# EAGLE design bioamplifierALL201820 (EAGLE 7.7.0)

## Sheet 1 of 2
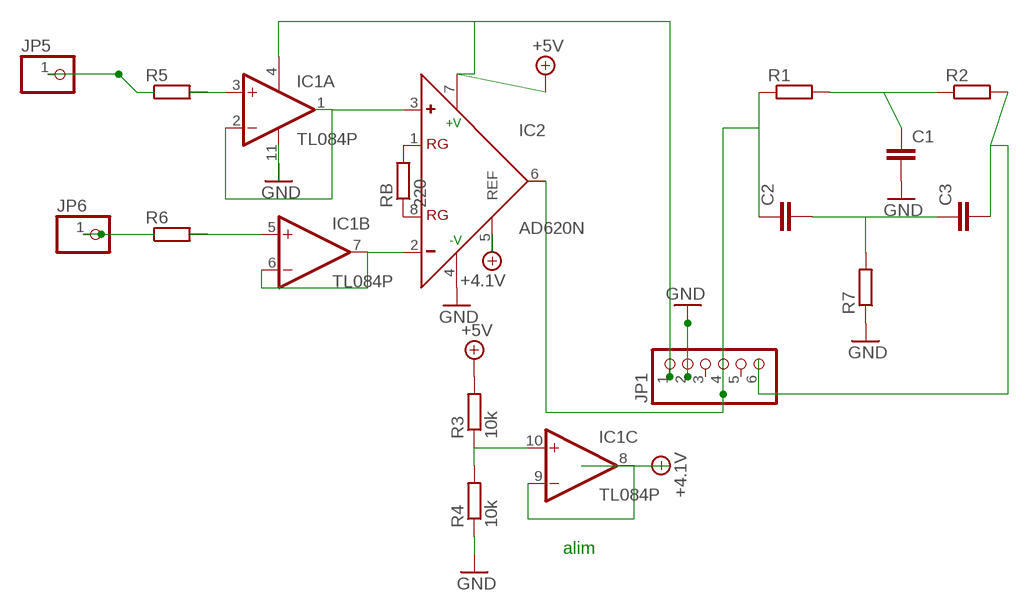
[diagram p0: schematic, sheet 1]

### Parts
C1  C-EU050-025X075  [C050-025X075]
C2  C-EU050-025X075  [C050-025X075]
C3  C-EU050-025X075  [C050-025X075]
IC1  TL084P  [DIL14]
IC2  AD620N  [DIL08]
JP1  PINHD-1X6  [1X06]
JP5  PINHD-1X1  [1X01]
JP6  PINHD-1X1  [1X01]
R1  R-EU_0204/7  [0204/7]
R2  R-EU_0204/7  [0204/7]
R3  10k  R-EU_0204/5  [0204/5]
R4  10k  R-EU_0204/5  [0204/5]
R5  R-EU_0204/5  [0204/5]
R6  R-EU_0204/5  [0204/5]
R7  R-EU_0204/7  [0204/7]
RB  220  R-EU_0204/5  [0204/5]

### Nets
+4.1V: IC2.5(REF)
+5V: IC1.4(P:V+) IC2.7(+V) JP1.1 R3.2
GND: C1.2 IC1.11(P:V-) IC2.4(-V) JP1.2 R4.1 R7.1
N$2: IC1.10(C:+IN) R3.1 R4.2
N$3: IC2.1(RG) RB.2
N$4: JP1.4
N$5: JP5.1 R5.1
N$6: IC1.1(A:OUT) IC1.2(A:-IN) IC2.3(+)
N$7: JP6.1 R6.1
N$8: IC1.5(B:+IN) R6.2
N$9: C1.1 R1.2 R2.1
N$10: C3.2 JP1.6 R2.2
N$11: IC2.8(RG) RB.1
N$12: IC1.3(A:+IN) R5.2
N$14: C2.1 IC2.6(OUT) R1.1
N$15: IC1.8(C:OUT) IC1.9(C:-IN)
N$16: C2.2 C3.1 R7.2
N$17: IC1.6(B:-IN) IC1.7(B:OUT) IC2.2(-)
Unconnected: IC1.12(D:+IN) IC1.13(D:-IN) IC1.14(D:OUT) JP1.3 JP1.5

### Notes on the sheet
- alim

## Sheet 2 of 2

## Library data of the parts
C1-C3 = resistor:C-EU: CAPACITOR, European symbol
IC1 = linear:TL084: OP AMP
IC2 = analog-devices:AD620: Low Cost, Low Power, Instrumentation Amplifier Source: http://www.analog.com/UploadedFiles/Data_Sheets/37793330023930AD620_e.pdf; MF: ALTERA CORPORATION; MPN: AD620AN; OC_FARNELL: 1523782; OC_NEWARK: 05F7108
JP1 = pinhead:PINHD-1X6: PIN HEADER
JP5 JP6 = pinhead:PINHD-1X1: PIN HEADER
R1-R7 RB = resistor:R-EU_: RESISTOR, European symbol

## Board
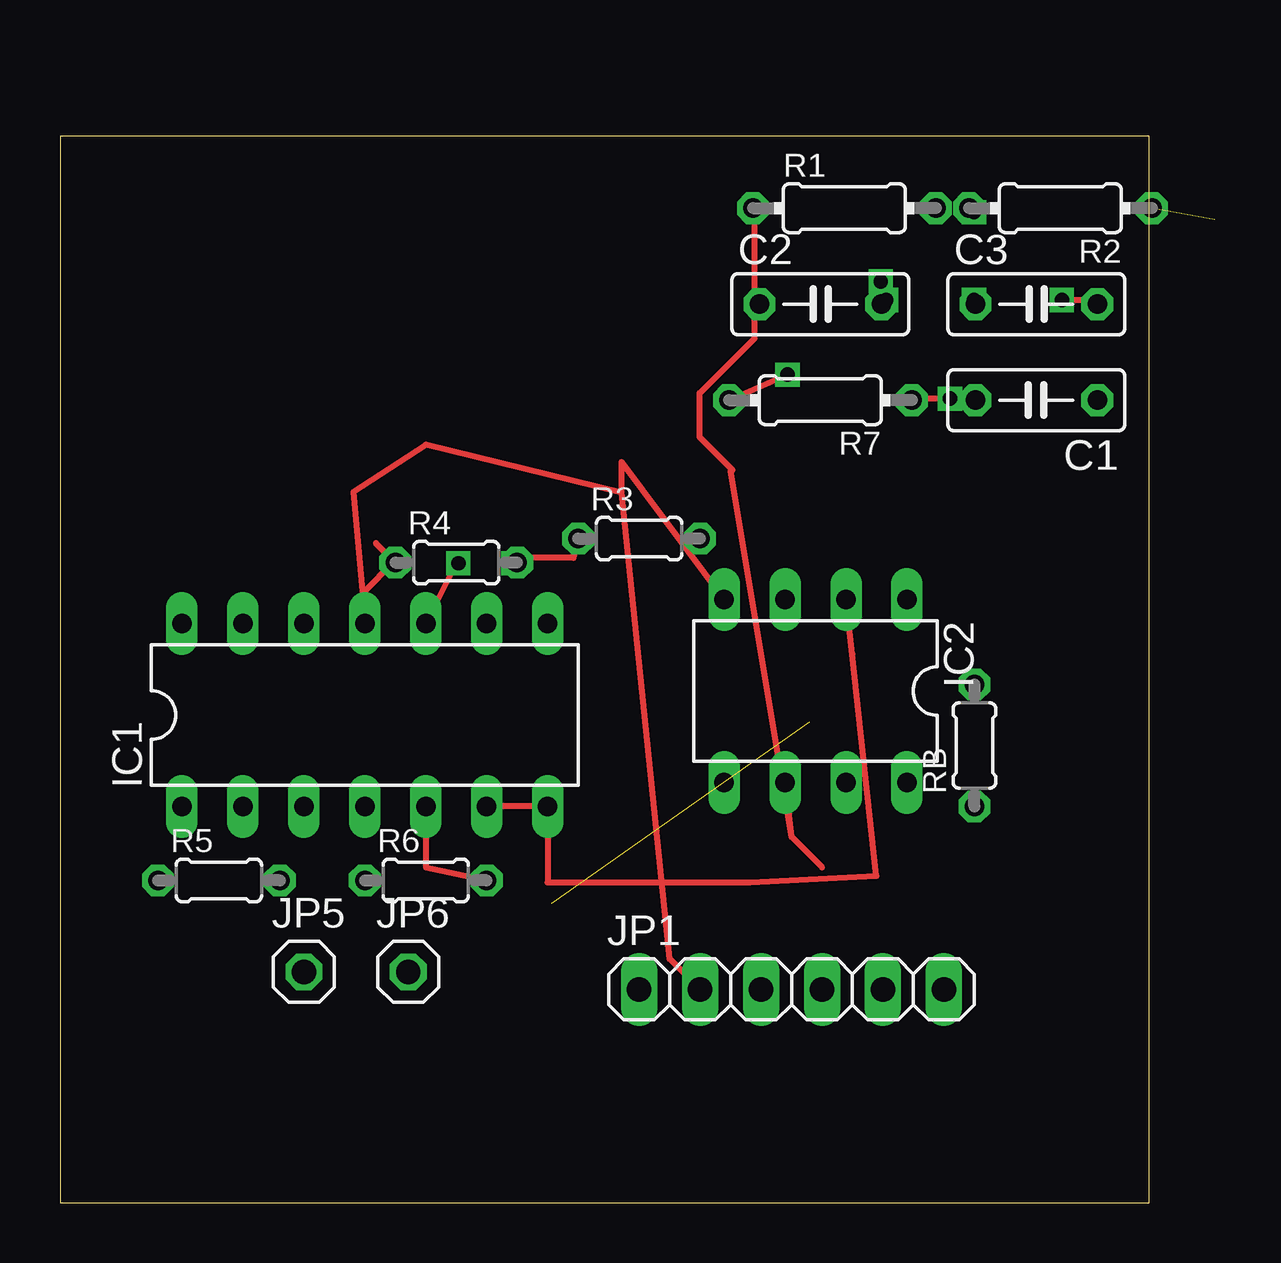
[diagram p1: board, top side]
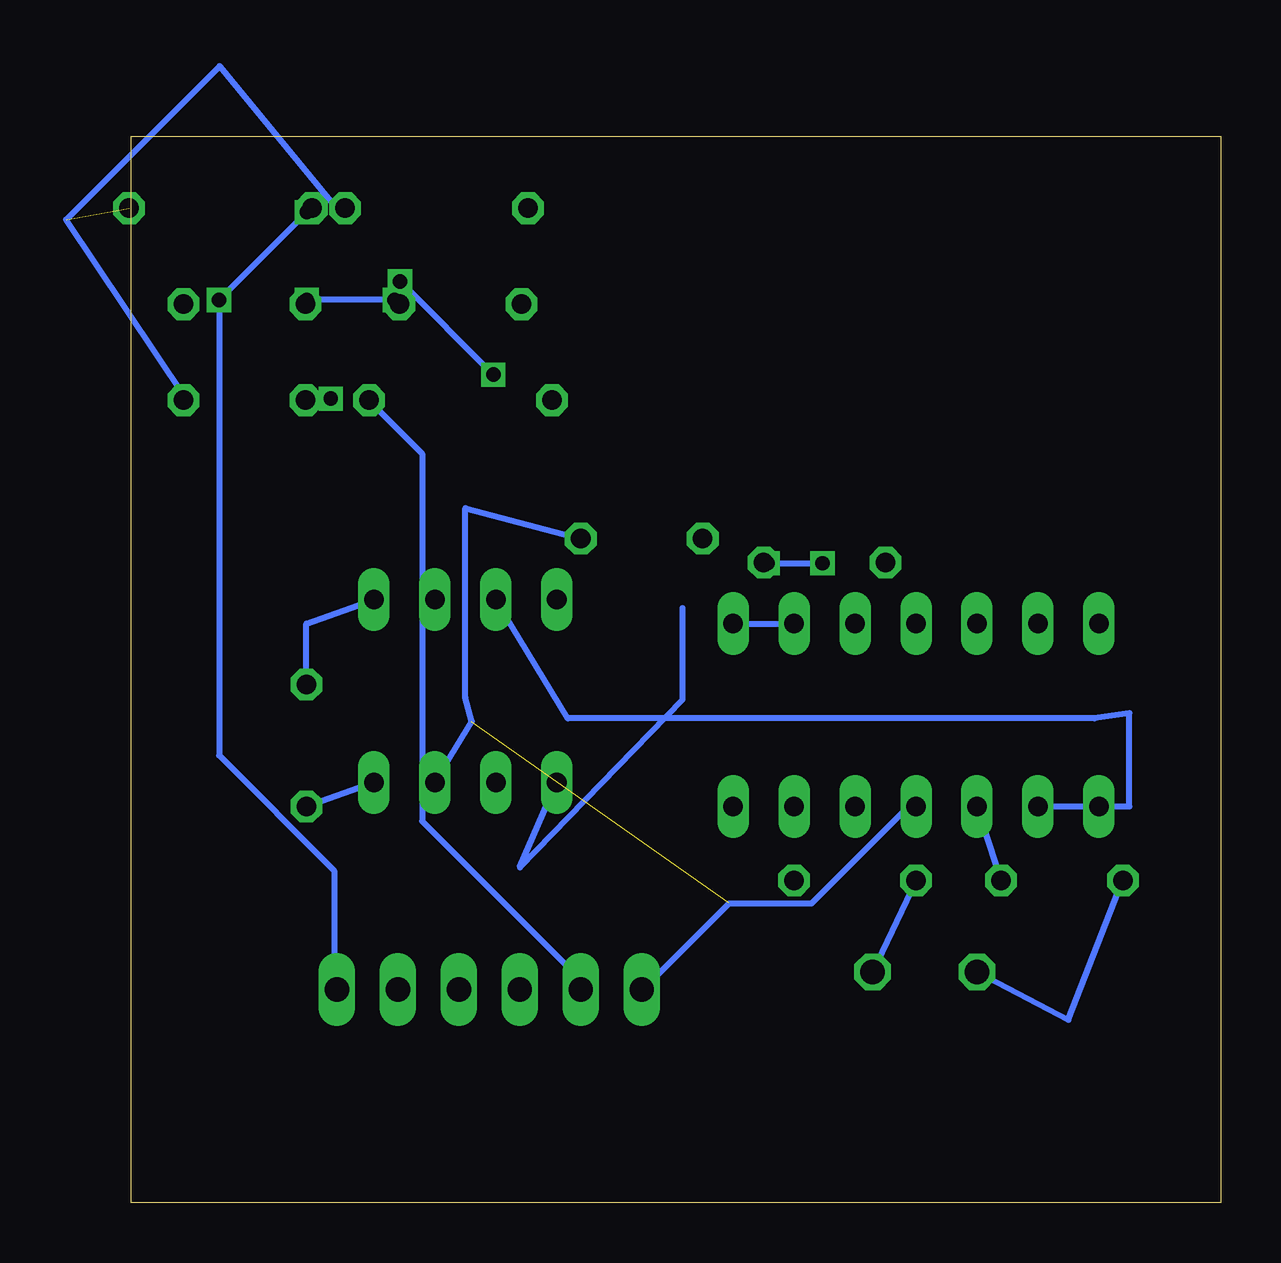
[diagram p2: board, bottom side, seen from below]

Size 45.39 x 44.44 mm. Coordinates in mm from the lower left corner, seen from the top.
Outline: 0,0 45.39,0 45.39,44.44 0,44.44 0,0
Copper layers (1*16): Top 0.035mm / dielectric 1.5mm / Bottom 0.035mm
Design rules "default": minimum track width 10mil, minimum drill 24mil, track to track 8mil, track to pad 8mil, pad to pad 8mil, via to via 8mil, smd to smd 8mil, copper to edge 40mil, drill to drill 8mil, minimum pad ring 10mil, minimum via ring 8mil, stop-mask expansion 4mil, vias tented up to drill 0mil, thermal gap 10mil

### Footprints (pad centres in the part's own frame; a part is rotated, then mirrored left to right if it is on the bottom)
C050-025X075 = drill 0.813 octagon: 1 -2.54,0; 2 2.54,0
DIL14 = drill 0.813 long: 1 -7.62,-3.81; 2 -5.08,-3.81; 3 -2.54,-3.81; 4 0,-3.81; 5 2.54,-3.81; 6 5.08,-3.81; 7 7.62,-3.81; 8 7.62,3.81; 9 5.08,3.81; 10 2.54,3.81; 11 0,3.81; 12 -2.54,3.81; 13 -5.08,3.81; 14 -7.62,3.81
DIL08 = drill 0.813 long: 1 -3.81,-3.81; 2 -1.27,-3.81; 3 1.27,-3.81; 4 3.81,-3.81; 5 3.81,3.81; 6 1.27,3.81; 7 -1.27,3.81; 8 -3.81,3.81
1X06 = drill 1.016 long: 1 -6.35,0; 2 -3.81,0; 3 -1.27,0; 4 1.27,0; 5 3.81,0; 6 6.35,0
1X01 = drill 1.016 octagon: 1 0,0
0204/7 = drill 0.813 octagon: 1 -3.81,0; 2 3.81,0
0204/5 = drill 0.813 octagon: 1 -2.54,0; 2 2.54,0

### Placement (x,y rotation side)
C1  40.68,33.44 180 top
C2  31.68,37.44 0 top
C3  40.68,37.44 0 top
IC1  12.7,20.32 0 top
IC2  31.48,21.32 180 top
JP1  30.48,8.89 0 top
JP5  10.16,9.62 0 top
JP6  14.51,9.62 0 top
R1  32.68,41.44 0 top
R2  41.68,41.44 180 top
R3  24.13,27.67 0 top
R4  16.51,26.67 0 top
R5  6.62,13.43 0 top
R6  15.24,13.43 0 top
R7  31.68,33.44 180 top
RB  38.1,19.05 90 top

### Tracks (layer width: path | path; a pad name or v marks a point on that pad's centre or on a via)
+4.1V
  Bottom 0.254: IC2.5 29.21,13.97 22.43,20.97 22.43,24.78
+5V  (1 unrouted)
  Bottom 0.254: 31.21,20.05 31.24,20.05 | IC2.7 31.21,20.05 | R3.2 31.48,28.94 31.48,21.05 31.21,20.05 | IC1.4 12.71,16.36 13.17,16.36 17.05,12.47 20.48,12.47 23.91,9.04 JP1.1
GND  (via drill 0.6)
  Top 0.254: 13.16,27.48 R4.1 13.85,26.64 12.71,25.5 12.71,24.36 IC1.11 12.22,29.61 15.24,31.59 23.4,29.59 | IC2.4 23.4,30.86 23.4,29.59 | 23.4,29.59 25.4,10.16 JP1.2 | v37.09,33.5 35.57,33.5 R7.1
  Bottom 0.254: v37.09,33.5 C1.2 | JP1.2 26.88,9.04 26.88,9.5 33.28,15.9 33.28,31.21 35.34,33.27 R7.1
N$2  (via drill 0.6)
  Top 0.254: IC1.10 16.51,26.67 v16.6,26.64 | R3.1 21.4,26.87 19.11,26.87 R4.2 v18.88,26.64
  Bottom 0.254: v18.88,26.64 v16.6,26.64
N$3
  Bottom 0.254: IC2.1 38.1,24.13 RB.2
N$5
  Bottom 0.254: R5.1 6.35,7.62 JP5.1
N$6
  Bottom 0.254: IC1.2 IC1.1 3.81,16.51 3.81,20.4 5.27,20.18 27.21,20.18 IC2.3
N$7
  Bottom 0.254: JP6.1 R6.1
N$8
  Top 0.254: R6.2 15.24,13.97 IC1.5
N$9  (1 unrouted)
  Bottom 0.254: R1.2 36.71,41.27 41.71,47.36 48.11,40.96 43.11,33.5 C1.1
N$10  (via drill 0.6)
  Top 0.254: v41.74,37.62 43.11,37.62 C3.2 | v38.09,41.27 R2.2 | v36.94,9.04 JP1.6
  Bottom 0.254: v38.09,41.27 v41.74,37.62 41.74,18.64 36.94,13.84 v36.94,9.04
N$11
  Bottom 0.254: RB.1 IC2.8
N$12
  Bottom 0.254: IC1.3 R5.2
N$14
  Top 0.254: 31.75,13.97 30.48,15.24 | 30.48,15.24 IC2.6 | 30.48,15.24 27.94,30.48 28.03,30.53 26.66,31.9 26.66,33.73 28.94,36.02 28.94,37.39 C2.1 28.94,37.62 28.94,41.27 R1.1
N$15
  Bottom 0.254: IC1.8 IC1.9
N$16  (via drill 0.6)
  Top 0.254: v30.31,34.5 28.03,33.5 R7.2 | v34.2,38.39 C2.2 v34.43,37.62 | v38.09,37.62 C3.1
  Bottom 0.254: v34.2,38.39 v30.31,34.5 | v34.43,37.62 v38.09,37.62
N$17
  Top 0.254: IC1.6 IC1.7 20.32,13.35 28.75,13.35 34.02,13.62 33.02,22.86 IC2.2